# EAGLE board pbusRX8E (EAGLE 6.6.0)
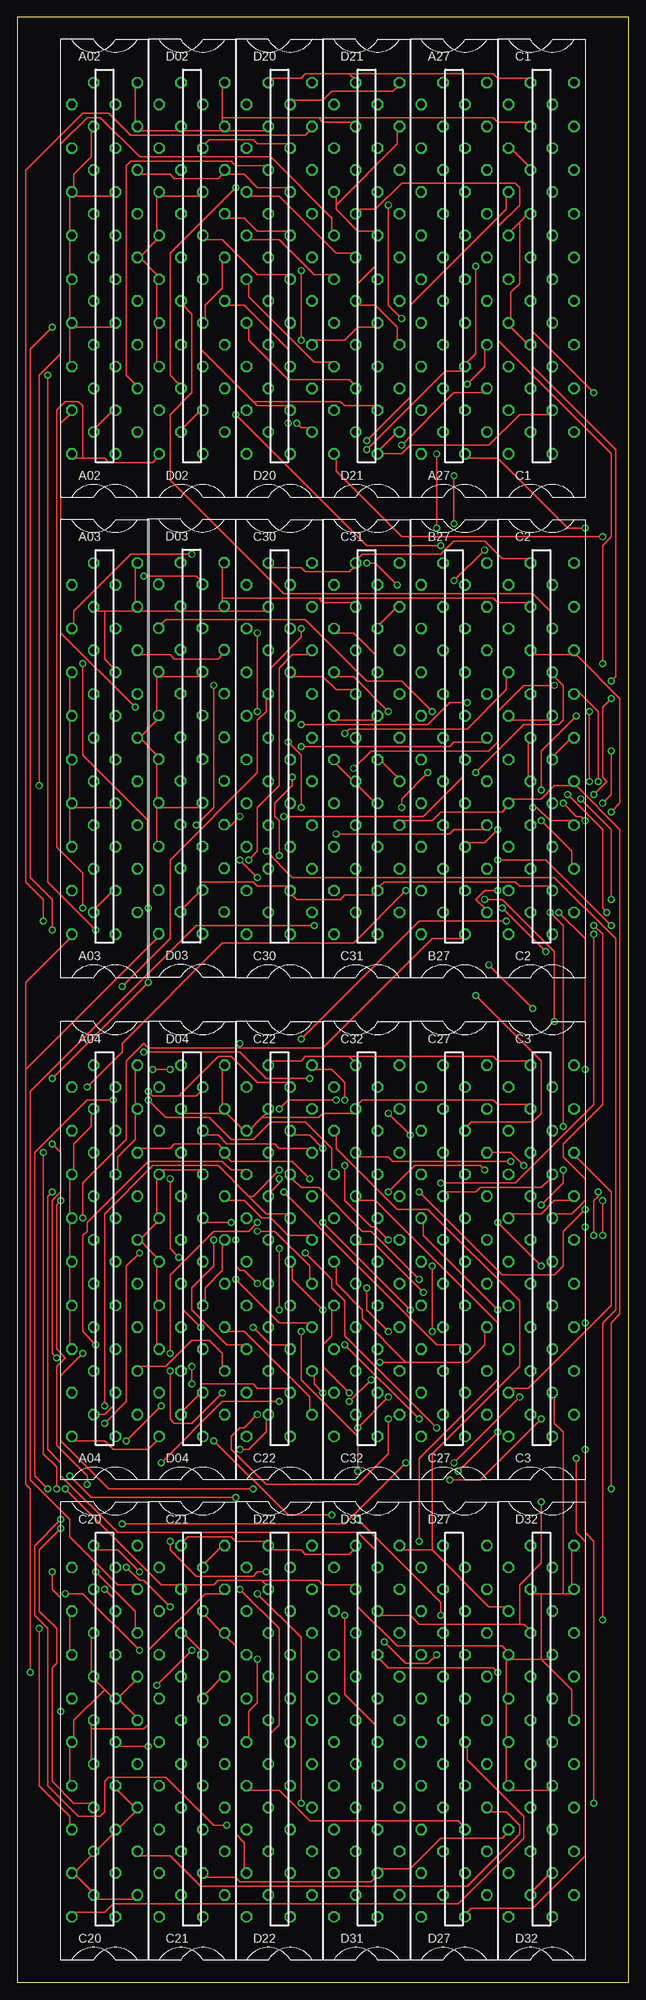
[diagram p1: board, top side]
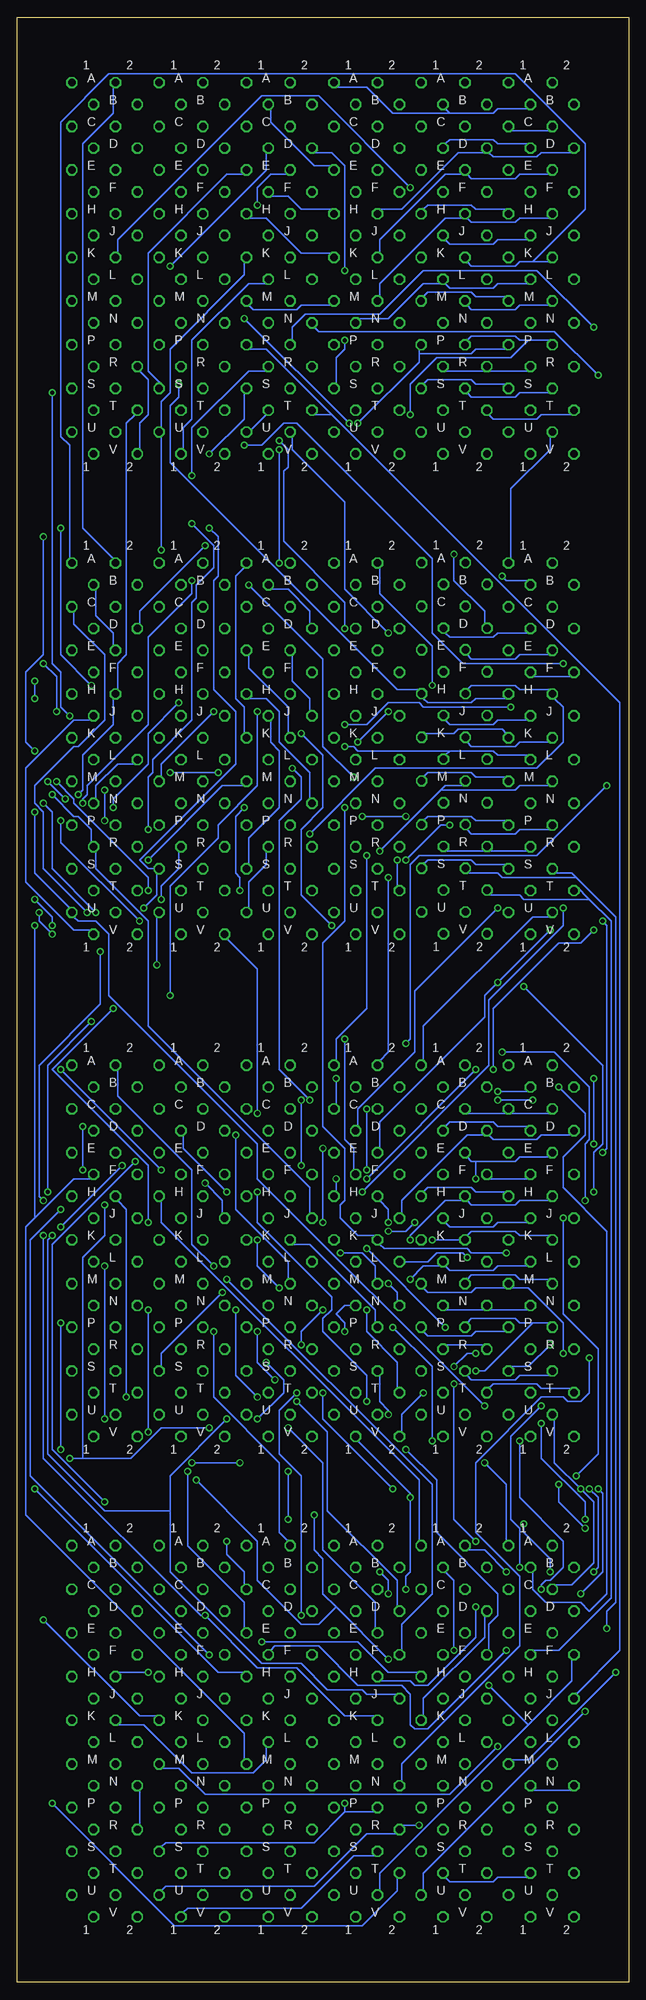
[diagram p2: board, bottom side, seen from below]

Size 88.9 x 285.75 mm. Coordinates in mm from the lower left corner, seen from the top.
Outline: 0,0 88.9,0 88.9,285.75 0,285.75 0,0
Copper layers (1*16): Top 0.035mm / dielectric 1.5mm / Bottom 0.035mm
Design rules "olimex10mil": minimum track width 10mil, minimum drill 24mil, track to track 10mil, track to pad 10mil, pad to pad 10mil, via to via 10mil, smd to smd 10mil, copper to edge 40mil, drill to drill 10mil, minimum pad ring 10mil, minimum via ring 8mil, stop-mask expansion 0mil, vias tented up to drill 0mil, thermal gap 10mil
Net classes: 1 Supply: width 1.905 mm, clearance 0.508 mm

## Footprints (pad centres in the part's own frame; a part is rotated, then mirrored left to right if it is on the bottom)
H807 = drill 1.092 octagon: A1 4.763,28.575; A2 -1.587,28.575; B1 1.587,25.4; B2 -4.763,25.4; C1 4.763,22.225; C2 -1.587,22.225; D1 1.587,19.05; D2 -4.763,19.05; E1 4.763,15.875; E2 -1.587,15.875; F1 1.587,12.7; F2 -4.763,12.7; H1 4.763,9.525; H2 -1.587,9.525; J1 1.587,6.35; J2 -4.763,6.35; K1 4.763,3.175; K2 -1.587,3.175; L1 1.587,0; L2 -4.763,0; M1 4.763,-3.175; M2 -1.587,-3.175; N1 1.587,-6.35; N2 -4.763,-6.35; P1 4.763,-9.525; P2 -1.587,-9.525; R1 1.587,-12.7; R2 -4.763,-12.7; S1 4.763,-15.875; S2 -1.587,-15.875; T1 1.587,-19.05; T2 -4.763,-19.05; U1 4.763,-22.225; U2 -1.587,-22.225; V1 1.587,-25.4; V2 -4.763,-25.4

## Placement (x,y rotation side)
A02  M903  [H807]  12.7,247.65 0 top
A03  M903  [H807]  12.7,177.8 0 top
A04  M903  [H807]  12.7,104.78 0 top
A27  [H807]  63.5,247.65 0 top
B27  [H807]  63.5,177.8 0 top
C1  [H807]  76.2,247.65 0 top
C2  [H807]  76.2,177.8 0 top
C3  M310  [H807]  76.2,104.78 0 top
C20  [H807]  12.7,34.92 0 top
C21  [H807]  25.4,34.92 0 top
C22  M624  [H807]  38.1,104.78 0 top
C27  [H807]  63.5,104.78 0 top
C30  M310  [H807]  38.1,177.8 0 top
C31  [H807]  50.8,177.8 0 top
C32  M002  [H807]  50.8,104.78 0 top
D02  M903  [H807]  25.4,247.65 0 top
D03  M903  [H807]  25.34,177.86 0 top
D04  M903  [H807]  25.4,104.78 0 top
D20  [H807]  38.1,247.65 0 top
D21  [H807]  50.8,247.65 0 top
D22  M002  [H807]  38.1,34.92 0 top
D27  [H807]  63.5,34.92 0 top
D31  [H807]  50.8,34.92 0 top
D32  M903  [H807]  76.2,34.92 0 top

## Tracks (layer width: path | path; a pad name or v marks a point on that pad's centre or on a via)
AC00L  (via drill 0.61)
  Top 0.254: v19.05,129.54 19.68,128.91 23.5,128.91 | 23.5,128.91 26.04,128.91 26.67,129.54 D04.B1 | 23.5,128.91 29.21,134.62 31.11,134.62 34.92,130.81 39.37,130.81 C22.B1
  Bottom 0.254: v19.05,129.54 14.61,129.54 A04.B1
AC01L
  Top 0.254: C22.E1 42.55,121.28 38.1,121.28 37.47,121.92 30.48,121.92 29.21,123.19 27.3,123.19 D04.D1
  Bottom 0.254: A04.D1 14.61,124.46 19.05,124.46 19.68,125.09 26.04,125.09 26.67,124.46 D04.D1
AC02L  (via drill 0.61)
  Top 0.254: A04.E1 17.78,121.28 22.23,121.28 22.86,121.92 29.21,121.92 29.84,121.28 D04.E1 30.48,120.02 31.11,119.38 40.01,119.38 v42.55,116.84
  Bottom 0.254: v42.55,116.84 42.55,114.94 C22.H1
AC03L
  Top 0.254: C22.K1 42.55,108.58 39.37,108.58 36.83,111.12 35.56,111.12 33.02,113.67 30.48,113.67 D04.H1
  Bottom 0.254: A04.H1 17.78,114.94 22.23,114.94 22.86,115.57 29.21,115.57 29.84,114.94 D04.H1
AC04L  (via drill 0.61)
  Top 0.254: v34.92,109.22 37.47,109.22 42.55,104.14 42.55,102.23 C22.M1 | v31.11,110.49 27.3,110.49 D04.J1
  Bottom 0.254: A04.J1 14.61,110.49 19.05,110.49 19.68,109.86 26.04,109.86 26.67,110.49 D04.J1 | v34.92,109.22 32.38,109.22 v31.11,110.49
AC05L  (via drill 0.61)
  Top 0.254: v31.75,102.23 38.1,95.89 42.55,95.89 C22.P1
  Bottom 0.254: A04.L1 14.61,104.14 19.05,104.14 19.68,103.5 26.04,103.5 26.67,104.14 D04.L1 27.3,104.14 29.84,104.14 v31.75,102.23
AC06L  (via drill 0.61)
  Top 0.254: v44.45,85.72 43.18,87 43.18,88.27 C22.S1 | v34.29,71.75 13.34,71.75 6.35,78.74 6.35,88.27 v9.53,91.44
  Bottom 0.254: D04.M1 29.84,100.97 29.21,100.33 22.86,100.33 22.23,100.97 17.78,100.97 A04.M1 17.14,100.97 14.61,100.97 9.53,95.89 v9.53,91.44 | v44.45,85.72 44.45,81.92 v34.29,71.75
AC07L
  Top 0.254: C22.U1 42.55,83.19 42.55,85.09 33.02,94.61 30.48,94.61 D04.P1
  Bottom 0.254: A04.P1 17.78,94.61 22.23,94.61 22.86,93.98 29.21,93.98 29.84,94.61 D04.P1
AC08L  (via drill 0.61)
  Top 0.254: A04.S1 17.78,89.53 21.59,89.53 25.4,93.34 27.94,93.34 29.84,91.44 29.84,89.53 D04.S1 | v11.43,92.71 9.53,94.61 9.53,108.58 10.16,109.22 10.16,110.49 19.05,119.38 29.84,119.38 31.11,118.11 33.02,118.11 C22.F2
  Bottom 0.254: v11.43,92.71 14.61,89.53 17.14,89.53 A04.S1
AC09L
  Bottom 0.254: A04.D2 8.26,123.19 12.7,123.19 13.34,122.56 19.68,122.56 20.32,123.19 D04.D2 20.95,123.19 23.5,123.19 33.02,113.67 33.02,111.76 C22.J2
AC10L  (via drill 0.61)
  Top 0.254: v23.5,105.41 22.23,106.68 v22.23,116.84
  Bottom 0.254: 22.23,119.38 22.86,119.38 23.5,120.02 D04.E2 | 22.23,119.38 16.51,119.38 15.88,120.02 11.43,120.02 A04.E2 | v23.5,105.41 24.13,106.05 27.94,106.05 29.21,104.78 C22.L2 | v22.23,116.84 22.23,119.38
AC11L  (via drill 0.61)
  Top 0.254: v34.92,101.6 33.02,103.5 32.38,103.5 31.75,104.14 v31.75,107.95
  Bottom 0.254: A04.H2 11.43,113.67 15.88,113.67 16.51,113.03 22.86,113.03 23.5,113.67 D04.H2 24.13,113.67 26.67,113.67 31.75,108.58 v31.75,107.95 | v34.92,101.6 33.66,100.33 33.66,99.06 C22.N2
BAC00
  Bottom 0.254: 26.04,271.78 19.68,271.78 19.05,272.42 14.61,272.42 A02.B1 | 26.04,271.78 26.67,272.42 D02.B1 | 26.04,271.78 34.29,271.78 38.1,275.59 42.55,275.59 D20.A1
BAC01
  Top 0.254: D20.D1 39.37,267.33 34.92,267.33 34.29,267.97 27.94,267.97 27.3,267.33 D02.D1
  Bottom 0.254: A02.D1 14.61,267.33 19.05,267.33 19.68,267.97 26.04,267.97 26.67,267.33 D02.D1
BAC02
  Top 0.254: A02.E1 17.78,262.89 22.23,262.89 22.86,262.25 29.21,262.25 29.84,262.89 D02.E1 30.48,262.89 33.02,262.89 34.92,260.99 39.37,260.99 D20.F1
BAC03
  Top 0.254: D20.J1 39.37,254.63 34.92,254.63 33.02,256.54 30.48,256.54 D02.H1
  Bottom 0.254: A02.H1 17.78,257.81 22.23,257.81 22.86,258.44 29.21,258.44 29.84,257.81 D02.H1
BAC04
  Top 0.254: D20.L1 39.37,248.28 34.92,248.28 29.84,253.37 27.3,253.37 D02.J1
  Bottom 0.254: A02.J1 14.61,253.37 19.05,253.37 19.68,252.73 26.04,252.73 26.67,253.37 D02.J1
BAC05
  Bottom 0.254: A02.L1 14.61,247.01 19.05,247.01 19.68,246.38 26.04,246.38 26.67,247.01 D02.L1 27.3,247.01 29.84,247.01 34.92,241.94 39.37,241.94 D20.N1
BAC06
  Top 0.254: D20.R1 39.37,235.59 39.37,237.49 33.02,243.84 30.48,243.84 D02.M1
  Bottom 0.254: A02.M1 17.78,245.11 22.23,245.11 22.86,245.75 29.21,245.75 29.84,245.11 D02.M1
BAC07  (via drill 0.61)
  Top 0.254: v39.37,226.69 39.37,222.88 D20.V1
  Bottom 0.254: v39.37,226.69 30.48,235.59 30.48,236.85 | 30.48,236.85 30.48,237.49 D02.P1 | 30.48,236.85 22.86,236.85 22.23,237.49 17.78,237.49 A02.P1
BAC08
  Top 0.254: D20.E2 36.2,264.16 31.75,264.16 31.11,264.8 16.51,264.8 15.88,264.16 15.88,233.68 17.14,232.41 A02.S1
  Bottom 0.254: A02.S1 17.78,232.41 22.23,232.41 22.86,233.04 29.21,233.04 29.84,232.41 D02.S1
BAC09
  Bottom 0.254: A02.D2 8.26,266.06 12.7,266.06 13.34,265.43 19.68,265.43 20.32,266.06 D02.D2 20.95,266.06 24.77,266.06 33.02,257.81 36.2,257.81 D20.H2
BAC10
  Bottom 0.254: A02.E2 11.43,262.89 15.88,262.89 16.51,262.25 22.86,262.25 23.5,262.89 D02.E2 24.13,262.89 26.67,262.89 36.2,253.37 36.2,251.46 D20.K2
BAC11
  Bottom 0.254: A02.H2 11.43,256.54 15.88,256.54 16.51,255.91 22.86,255.91 23.5,256.54 D02.H2 24.13,256.54 26.67,256.54 36.2,247.01 36.2,245.11 D20.M2
BACLR  (via drill 0.61)
  Top 0.254: v29.84,85.72 25.4,81.28 22.86,81.28 22.23,81.92 v22.23,88.9
  Bottom 0.254: 13.97,95.89 15.88,95.89 16.51,96.52 22.86,96.52 23.5,95.89 D04.P2 | 13.97,95.89 11.43,95.89 A04.P2 | v29.84,85.72 33.02,82.55 33.02,80.01 C22.V2 | v22.23,88.9 20.95,88.9 13.97,95.89
BINIT  (via drill 0.61)
  Top 0.254: 9.53,221.62 12.7,221.62 13.34,220.98 19.68,220.98 20.32,221.62 D02.V2 | 9.53,221.62 8.26,221.62 A02.V2 | v38.73,114.94 60.96,92.71 64.77,92.71 C27.R1 | v9.53,156.21 9.53,161.29 5.71,165.1 5.71,228.6 6.99,229.87 8.89,229.87 9.53,229.24 9.53,221.62
  Bottom 0.254: v38.73,114.94 20.32,133.35 20.32,142.88 9.53,153.67 v9.53,156.21
BIOP1
  Bottom 0.254: 13.97,250.19 15.88,250.19 16.51,249.56 22.86,249.56 23.5,250.19 D02.K2 | 13.97,250.19 11.43,250.19 A02.K2 | 13.97,250.19 6.35,257.81 6.35,267.33 16.51,277.5 75.56,277.5 82.55,270.51 82.55,224.79 81.28,223.52 81.28,207.01 C2.A1
BIOP2
  Top 0.254: C2.D1 77.47,197.49 77.47,199.39 74.93,201.93 38.73,201.93 22.23,218.44 22.23,227.97 25.4,231.14 25.4,242.57 24.13,243.84 D02.M2
  Bottom 0.254: A02.M2 11.43,243.84 15.88,243.84 16.51,243.21 22.86,243.21 23.5,243.84 D02.M2
BIOP4  (via drill 0.61)
  Top 0.254: v61.59,208.91 50.8,208.91 v31.75,227.97
  Bottom 0.254: 14.61,238.76 15.88,238.76 16.51,239.4 22.86,239.4 23.5,238.76 D02.P2 | 14.61,238.76 11.43,238.76 A02.P2 | v61.59,208.91 71.12,199.39 71.12,197.49 C2.D2 | v31.75,227.97 31.75,232.41 27.94,236.22 17.14,236.22 14.61,238.76
BIRQ  (via drill 0.61)
  Top 0.254: v38.1,106.68 v38.1,97.79 | v26.67,95.25 24.13,97.79 24.13,100.97 D04.M2
  Bottom 0.254: A04.M2 11.43,102.23 15.88,102.23 16.51,102.87 22.86,102.87 23.5,102.23 D04.M2 | v38.1,97.79 38.1,94.61 33.66,90.17 33.66,86.36 C22.T2 | v26.67,95.25 v38.1,106.68
BMB00  (via drill 0.61)
  Top 0.254: v18.41,204.47 26.04,204.47 26.67,203.84 D03.B1
  Bottom 0.254: v18.41,204.47 17.78,203.84 14.61,203.84 A03.B1
BMB01
  Bottom 0.254: A03.D1 14.61,196.22 19.05,196.22 19.68,195.58 26.04,195.58 26.67,196.22 D03.D1
BMB02
  Top 0.254: A03.E1 17.78,193.04 22.23,193.04 22.86,192.41 29.21,192.41 29.84,193.04 D03.E1
BMB03
  Bottom 0.254: A03.J1 14.61,183.51 19.05,183.51 19.68,182.88 26.04,182.88 26.67,183.51 D03.J1
BMB03L  (via drill 0.61)
  Top 0.254: v65.41,232.41 67.94,234.95 67.94,237.49 A27.P1
  Bottom 0.254: A03.H1 17.78,186.69 22.23,186.69 22.86,186.06 29.21,186.06 29.84,186.69 D03.H1 30.48,187.96 33.66,187.96 66.67,220.98 66.67,229.24 65.41,230.5 v65.41,232.41
BMB04
  Bottom 0.254: A03.M1 17.78,175.26 22.23,175.26 22.86,175.9 29.21,175.9 29.84,175.26 D03.M1
BMB04L  (via drill 0.61)
  Top 0.254: v41.27,179.71 62.87,179.71 63.5,180.34 67.94,180.34 B27.K1
  Bottom 0.254: 26.04,179.07 19.68,179.07 19.05,178.44 14.61,178.44 A03.L1 | 26.04,179.07 26.67,178.44 D03.L1 | v41.27,179.71 40.01,179.71 39.37,179.07 26.04,179.07
BMB05
  Bottom 0.254: A03.S1 17.78,162.56 22.23,162.56 22.86,163.19 29.21,163.19 29.84,162.56 D03.S1
BMB05L  (via drill 0.61)
  Top 0.254: v38.73,169.54 59.05,169.54 64.77,175.26 64.77,177.16 B27.L1 | v32.38,169.54 30.48,167.64 D03.P1
  Bottom 0.254: A03.P1 17.78,168.91 22.23,168.91 22.86,169.54 29.21,169.54 29.84,168.91 D03.P1 | v32.38,169.54 v38.73,169.54
BMB06
  Bottom 0.254: A03.E2 11.43,193.04 15.88,193.04 16.51,192.41 22.86,192.41 23.5,193.04 D03.E2
BMB06L  (via drill 0.61)
  Top 0.254: v25.4,207.65 16.51,207.65 8.26,199.39 8.26,197.49 A03.D2 | v60.33,184.78 55.88,189.23 50.8,189.23 41.91,198.12 21.59,198.12 20.95,197.49 D03.D2
  Bottom 0.254: v25.4,207.65 25.4,203.84 20.95,199.39 20.95,197.49 D03.D2 | v60.33,184.78 67.94,177.16 67.94,175.26 B27.M1
BMB07
  Bottom 0.254: A03.K2 11.43,180.34 15.88,180.34 16.51,179.71 22.86,179.71 23.5,180.34 D03.K2
BMB07L  (via drill 0.61)
  Top 0.254: v46.35,167 62.87,167 63.5,167.64 67.94,167.64 B27.P1
  Bottom 0.254: D03.H2 23.5,187.96 22.86,188.59 16.51,188.59 15.88,187.96 11.43,187.96 A03.H2 10.79,186.69 9.53,185.42 9.53,180.34 13.34,176.53 36.83,176.53 v46.35,167
BMB08
  Bottom 0.254: A03.P2 11.43,167.64 15.88,167.64 16.51,167 22.86,167 23.5,167.64 D03.P2
BMB08L  (via drill 0.61)
  Top 0.254: v85.09,52.7 85.09,95.89 87,97.79 87,151.76 78.11,160.66 40.01,160.66 v36.2,164.47
  Bottom 0.254: v85.09,52.7 71.12,38.73 68.58,38.73 D27.K1 | 27.3,173.35 26.67,173.99 24.13,173.99 D03.M2 | v36.2,164.47 27.3,173.35 | 27.3,173.35 16.51,173.35 15.88,173.99 11.43,173.99 A03.M2
BMB09  (via drill 0.61)
  Top 0.254: v3.17,51.44 3.17,28.57 7.62,24.13 7.62,22.86 C20.R2
  Bottom 0.254: v3.17,51.44 3.17,53.98 1.91,55.24 1.91,154.94 7.62,160.66 | 7.62,160.66 8.26,161.29 10.79,161.29 A03.S2 | 7.62,160.66 18.41,160.66 19.05,161.29 23.5,161.29 D03.S2
BMB10
  Bottom 0.254: 5.71,157.48 7.62,159.38 A03.T2 | 5.71,157.48 2.54,154.31 2.54,55.88 10.16,48.26 13.97,48.26 C20.F1 | 5.71,157.48 15.24,157.48 15.88,158.12 20.32,158.12 D03.T2
BMB11  (via drill 0.61)
  Top 0.254: v1.91,45.09 1.91,71.75 1.27,72.39 1.27,132.72 | 1.27,132.72 1.27,145.41 7.62,151.76 A03.V2 | 1.27,132.72 20.32,151.76 D03.V2
  Bottom 0.254: v1.91,45.09 14.61,32.38 17.14,32.38 C20.M1
BRD_L  (via drill 0.61)
  Top 0.254: v6.35,66.04 3.17,62.87 3.17,53.98 5.71,51.44 5.71,46.35 5.08,45.72 5.08,29.21 8.26,26.04 10.79,26.04 C20.P2 | v10.16,72.39 10.16,73.66 5.71,78.11 5.71,89.53 6.99,90.81 5.71,92.08 5.71,113.03 v6.35,113.67 | v18.41,135.25 32.38,135.25 36.2,131.44 v42.55,131.44
  Bottom 0.254: v6.35,66.04 10.16,69.85 v10.16,72.39 | v6.35,113.67 6.35,121.92 5.71,122.56 5.71,130.18 10.79,135.25 v18.41,135.25 | v42.55,131.44 42.55,127.64 C22.C1
BRUN
  Bottom 0.254: A04.S2 11.43,88.27 15.88,88.27 16.51,87.63 22.86,87.63 23.5,88.27 D04.S2
BSKIP  (via drill 0.61)
  Top 0.254: v28.57,107.95 28.57,104.14 25.4,100.97 25.4,97.79 30.48,92.71 33.02,92.71 C22.R2
  Bottom 0.254: A04.K2 11.43,108.58 15.88,108.58 16.51,109.22 22.86,109.22 23.5,108.58 D04.K2 v28.57,107.95
BTS1  (via drill 0.61)
  Top 0.254: v74.93,170.81 75.56,170.81 77.47,168.91 80.64,168.91 C2.P1 | v65.41,186.06 62.87,186.06 59.69,182.88 v41.27,182.88 | v17.14,185.42 6.35,196.22 6.35,226.69 7.62,227.97 A02.T2
  Bottom 0.254: A02.T2 8.26,227.97 12.7,227.97 13.34,227.33 19.68,227.33 20.32,227.97 D02.T2 | v74.93,170.81 74.93,172.09 69.85,177.16 69.85,181.61 v65.41,186.06 | v41.27,182.88 38.1,182.88 34.92,186.06 30.48,186.06 29.84,185.42 v17.14,185.42
BTS3  (via drill 0.61)
  Top 0.254: v31.75,260.99 22.23,251.46 22.23,233.68 23.5,232.41 D02.S2
  Bottom 0.254: A02.S2 11.43,231.14 15.88,231.14 16.51,230.5 22.86,230.5 23.5,231.14 D02.S2 | v31.75,260.99 45.09,274.32 53.34,274.32 74.3,253.37 74.3,251.46 C1.K2
BWR_L
  Top 0.254: 46.35,258.44 46.35,257.81 49.53,254.63 52.07,254.63 D21.J1 52.07,253.37 52.07,249.56 49.53,247.01 49.53,245.11 D21.M2 49.53,243.84 52.07,243.84 55.24,240.66 55.24,238.76 D21.P1 | 46.35,258.44 46.35,259.71 D21.F2 | 46.35,258.44 55.24,267.33 55.24,269.24 D21.C1
  Bottom 0.254: 43.18,227.97 1.27,186.06 1.27,48.26 7.62,41.91 C20.J2 | 43.18,227.97 45.72,227.97 D21.T2 | 43.18,227.97 52.7,237.49 55.24,237.49 D21.P1
C0L  (via drill 0.61)
  Top 0.254: D22.T2 33.02,16.51 33.02,20.32 31.75,21.59 31.75,48.9 30.48,50.16 C21.E1 29.84,50.8 27.3,53.34 C21.D1 | v73.66,118.75 71.75,120.65 C27.E1 | v82.55,95.89 v82.55,109.86 | v82.55,77.47 82.55,65.41 83.82,64.14 v83.82,26.04
  Bottom 0.254: v82.55,109.86 v73.66,118.75 | v82.55,77.47 v82.55,95.89 | v83.82,26.04 66.04,8.26 38.73,8.26 33.66,13.34 33.66,15.24 D22.T2
C1L  (via drill 0.61)
  Top 0.254: C20.F2 7.62,48.26 7.62,53.34 C20.D2 | C21.B1 27.3,60.96 29.84,63.5 C21.A1 | v20.32,43.18 v25.4,48.26
  Bottom 0.254: 14.61,37.47 8.26,43.81 8.26,46.99 C20.F2 | 14.61,37.47 36.2,15.88 36.2,13.34 D22.U2 | C27.H1 67.94,113.67 67.94,110.49 30.48,73.03 30.48,64.14 C21.A1 | 14.61,37.47 v20.32,43.18 | v25.4,48.26 25.4,58.42 26.67,59.69 C21.B1
C20U1
  Top 0.254: 14.61,41.27 17.14,38.73 C20.K1 | 12.7,42.55 13.97,41.27 C20.J1 14.61,41.27 | 12.7,42.55 11.43,43.81 C20.H2 10.79,45.09 10.79,50.16 C20.E2 | 14.61,41.27 17.14,43.81 C20.H1 | C20.N2 7.62,29.21 7.62,34.29 C20.L2 8.26,35.56 8.26,38.1 12.7,42.55 | 8.26,15.88 10.79,13.34 C20.U2 11.43,12.06 17.14,12.06 C20.U1 | 8.26,15.88 10.79,18.41 C20.S2 11.43,19.05 13.97,21.59 C20.R1 14.61,22.23 17.14,24.77 C20.P1 17.14,25.4 14.61,27.94 C20.N1 | 8.26,15.88 C20.T2
  Bottom 0.254: C20.N2 8.26,27.94 13.97,27.94 C20.N1
C21U1  (via drill 0.61)
  Top 0.254: v6.35,39.37 6.35,55.88 5.08,57.15 v5.08,59.69 | v5.71,71.75 5.71,74.93 3.81,76.83 v3.81,120.65 | v3.81,154.31 3.81,157.48 1.27,160.02 1.27,263.52 9.53,271.78 13.34,271.78 16.51,268.61 41.91,268.61 42.55,269.24 D20.C1
  Bottom 0.254: v6.35,39.37 29.84,15.88 29.84,13.34 C21.U1 | v5.08,59.69 4.45,60.33 4.45,70.48 v5.71,71.75 | v3.81,120.65 3.17,121.28 3.17,153.67 v3.81,154.31
C32H2  (via drill 0.61)
  Top 0.254: v58.42,64.14 58.42,76.2 69.85,87.63 69.85,95.89 52.07,113.67 49.53,113.67 C32.H2
  Bottom 0.254: v58.42,64.14 58.42,62.23 55.88,59.69 55.88,57.78 D31.C1
DATA00LL  (via drill 0.61)
  Top 0.254: v66.67,249.56 66.67,236.85 65.41,235.59 A27.R1 64.77,234.31 62.23,234.31 v50.8,222.88 | v51.44,87.63 v48.26,84.45 | v53.98,94.61 50.8,97.79 v50.8,100.97 | v53.98,107.95 52.07,109.86 51.44,109.86 47.62,113.67 v47.62,118.75 | v47.62,128.27 47.62,130.81 45.72,132.72 43.18,132.72 C22.A1 | v50.8,206.38 52.07,206.38 v55.24,203.2 | v40.01,175.26 40.01,173.99 37.47,171.45 37.47,169.54 38.1,168.91 v38.1,163.83
  Bottom 0.254: v66.67,249.56 52.7,263.52 52.7,266.06 D21.D1 | v48.26,84.45 43.81,80.01 43.81,68.58 33.66,58.42 33.66,54.61 D22.D2 | v51.44,87.63 53.98,90.17 v53.98,94.61 | v50.8,100.97 53.98,104.14 v53.98,107.95 | v47.62,128.27 v47.62,118.75 | v50.8,206.38 v50.8,222.88 | v55.24,203.2 44.45,192.41 44.45,179.71 v40.01,175.26 | v38.1,163.83 38.1,141.6 42.55,137.16 42.55,133.99 C22.A1
DATA01L  (via drill 0.61)
  Top 0.254: v53.98,85.09 v49.53,80.64 | v44.45,110.49 v57.15,97.79 | v44.45,121.28 42.55,123.19 40.01,123.19 C22.D1 | v55.88,223.52 63.5,231.14 67.94,231.14 A27.S1 | v9.53,191.77 9.53,178.44 19.05,168.91 v19.05,156.21
  Bottom 0.254: D21.E1 55.88,262.89 58.42,262.89 69.85,251.46 69.85,234.31 67.94,232.41 A27.S1 | v49.53,80.64 44.45,75.56 44.45,62.87 36.83,55.24 36.83,51.44 D22.E2 | v53.98,85.09 57.15,88.27 v57.15,97.79 | v44.45,121.28 v44.45,110.49 | v55.88,223.52 53.34,223.52 50.16,226.69 48.26,226.69 28.57,207.01 28.57,196.22 24.13,191.77 v9.53,191.77 | v19.05,156.21 31.11,144.15 31.11,135.25 39.37,127 39.37,124.46 C22.D1
DATA02L  (via drill 0.61)
  Top 0.254: v58.42,102.23 51.44,109.22 50.16,109.22 43.81,115.57 41.27,115.57 40.01,116.84 C22.F1 | v63.5,203.84 v67.94,208.28 | v79.38,171.45 81.28,169.54 81.92,169.54 v82.55,168.91 | v71.12,154.31 58.42,154.31 v41.27,137.16
  Bottom 0.254: D21.K1 55.88,250.19 55.88,248.28 66.67,237.49 66.67,231.14 67.94,229.87 67.94,226.06 A27.U1 67.94,224.79 v67.94,208.28 | v58.42,102.23 28.57,72.39 28.57,56.52 33.02,52.07 33.02,48.26 D22.F2 | v63.5,203.84 63.5,201.93 69.85,195.58 69.85,182.88 78.74,173.99 78.74,172.72 79.38,172.09 v79.38,171.45 | v82.55,168.91 82.55,165.74 v71.12,154.31 | v41.27,137.16 41.27,122.56 40.01,121.28 40.01,118.11 C22.F1
DATA03L  (via drill 0.61)
  Top 0.254: v22.23,54.61 18.41,58.42 17.78,58.42 v15.88,60.33 | v12.7,83.82 12.7,111.76 19.68,118.75 29.21,118.75 33.66,114.3 | 33.66,114.3 36.2,111.76 39.37,111.76 C22.J1 | v82.55,211.46 80.01,211.46 69.85,221.62 65.41,221.62 A27.V1 | v78.11,188.59 73.66,188.59 69.85,184.78 69.85,180.34 68.58,179.07 51.44,179.07 v48.9,176.53 | v46.35,128.27 39.37,128.27 v38.1,127 | v38.1,118.11 34.29,114.3 33.66,114.3
  Bottom 0.254: D21.L1 52.7,247.01 55.24,247.01 63.5,238.76 63.5,227.33 64.77,226.06 64.77,222.88 A27.V1 | v22.23,54.61 22.23,50.16 29.21,43.18 31.11,43.18 31.75,43.81 36.2,43.81 D22.H2 | v15.88,60.33 15.88,66.04 17.14,67.31 17.14,79.38 v12.7,83.82 | v82.55,211.46 82.55,193.04 v78.11,188.59 | v48.9,176.53 47.62,175.26 47.62,172.09 50.8,168.91 50.8,132.72 v46.35,128.27 | v38.1,127 v38.1,118.11
DATA04L  (via drill 0.61)
  Top 0.254: v63.5,212.09 v63.5,219.07 | v69.85,167.64 67.94,165.74 65.41,165.74 B27.R1 | v58.42,81.92 v47.62,92.71 | v44.45,97.79 40.01,102.23 40.01,104.14 C22.L1 | v67.94,157.48 70.48,157.48 78.11,149.86 v78.11,139.7 | v84.45,114.94 84.45,114.3 83.82,113.67 v83.82,108.58
  Bottom 0.254: v63.5,219.07 63.5,226.06 55.24,234.31 52.7,234.31 D21.R1 | v63.5,212.09 60.33,208.91 60.33,205.74 62.87,203.2 62.87,201.29 63.5,200.66 63.5,183.51 69.22,177.8 69.22,175.9 69.85,175.26 v69.85,167.64 | 66.67,68.58 66.67,73.66 v58.42,81.92 | 66.67,68.58 66.67,59.69 53.34,46.35 47.62,46.35 43.81,42.55 38.73,42.55 38.1,41.91 33.66,41.91 D22.J2 | v47.62,92.71 47.62,94.61 v44.45,97.79 | v67.94,157.48 67.94,159.38 65.41,161.93 65.41,164.47 B27.R1 | v78.11,139.7 84.45,133.35 v84.45,114.94 | v83.82,108.58 84.45,107.95 84.45,76.83 76.2,68.58 66.67,68.58
DATA05L  (via drill 0.61)
  Top 0.254: v60.96,211.46 v60.96,222.25 | v61.59,53.34 61.59,55.24 v49.53,67.31 | v49.53,74.3 49.53,79.38 41.27,87.63 v41.27,94.61 | v70.48,156.21 v76.83,149.86 | v85.09,113.67 v85.09,108.58
  Bottom 0.254: v60.96,222.25 55.88,227.33 55.88,231.14 D21.S1 | v60.96,211.46 59.69,210.19 59.69,204.47 60.33,203.84 60.33,187.96 57.15,184.78 57.15,177.16 71.12,163.19 69.85,161.93 B27.S1 68.58,161.29 68.58,158.12 v70.48,156.21 | v49.53,67.31 v49.53,74.3 | v41.27,94.61 41.27,95.89 42.55,97.16 41.27,98.42 C22.N1 | D22.K2 36.83,38.73 41.27,38.73 48.26,45.72 53.98,45.72 v61.59,53.34 62.23,53.34 85.09,76.2 v85.09,108.58 | v76.83,149.86 76.83,142.24 85.72,133.35 85.72,114.3 v85.09,113.67
DATA06L  (via drill 0.61)
  Top 0.254: v34.92,46.99 34.92,40.64 33.66,39.37 33.66,35.56 D22.L2 | v45.72,67.94 39.37,67.94 v28.57,78.74 | v34.29,95.25 36.83,92.71 39.37,92.71 C22.R1 | v69.85,158.75 67.94,158.75 66.67,157.48 67.94,156.21 B27.U1 | v83.19,174.62 v83.19,184.78 | v85.09,191.77 85.09,208.91 86.36,210.19 86.36,222.25 69.85,238.76 69.85,255.27 73.03,258.44 73.03,260.99 72.39,261.62 55.88,261.62 52.07,257.81 49.53,257.81 D21.H2 | v62.87,73.03 67.31,73.03 v76.2,81.92 | v69.85,110.49 v76.2,104.14 | v68.58,147.96 v74.93,141.6
  Bottom 0.254: 42.55,54.61 44.45,56.52 44.45,61.59 45.72,62.87 v45.72,67.94 | 42.55,54.61 v34.92,46.99 | v28.57,78.74 28.57,89.53 v34.29,95.25 | v69.85,158.75 69.85,160.66 80.64,171.45 80.64,172.09 v83.19,174.62 | v83.19,184.78 83.19,189.87 v85.09,191.77 | 42.55,54.61 45.09,52.07 47.62,52.07 53.98,58.42 53.98,64.14 v62.87,73.03 | v76.2,104.14 v76.2,81.92 | v69.85,110.49 69.85,118.75 83.82,132.72 v74.93,141.6 | v68.58,147.96 68.58,154.94 B27.U1
DATA07L  (via drill 0.61)
  Top 0.254: v32.38,57.15 38.1,51.44 38.1,37.47 36.83,36.2 36.83,32.38 D22.M2 | 32.38,135.89 19.05,135.89 18.41,136.53 15.88,133.99 15.88,122.56 9.53,116.2 v9.53,111.12 | 32.38,135.89 44.45,135.89 60.33,151.76 64.77,151.76 B27.V1 | v7.62,73.66 10.79,70.48 v31.75,70.48 | v3.17,173.99 3.17,233.68 6.35,236.85 6.35,267.33 10.16,271.14 12.06,271.14 17.78,265.43 36.83,265.43 45.72,256.54 45.72,254.63 D21.J2 | v32.38,136.53 32.38,135.89
  Bottom 0.254: v32.38,57.15 32.38,59.05 31.75,59.69 v31.75,70.48 31.75,71.12 39.37,78.74 C22.V1 | v9.53,111.12 9.53,97.16 4.45,92.08 4.45,76.83 v7.62,73.66 | v3.17,173.99 13.34,163.83 30.48,163.83 31.75,162.56 31.75,137.16 v32.38,136.53
DATA08L  (via drill 0.61)
  Top 0.254: D22.N2 33.66,27.94 38.1,27.94 42.55,23.5 64.14,23.5 64.77,22.86 D27.R1 | v11.43,153.03 4.45,160.02 v4.45,233.68 | v5.71,90.81 5.08,91.44 5.08,113.67 6.35,114.94 6.35,120.65 v5.08,121.92 | v19.05,145.41 v5.08,131.44
  Bottom 0.254: v11.43,153.03 v19.05,145.41 20.95,143.51 20.95,140.34 36.2,125.09 36.2,121.28 C22.E2 | v4.45,233.68 10.79,240.03 45.09,240.03 45.72,240.66 D21.N2 | v5.71,90.81 5.71,85.72 6.99,84.45 8.89,84.45 9.53,85.09 12.7,85.09 22.23,75.56 22.23,65.41 15.88,59.05 15.88,48.9 33.02,31.75 33.02,29.21 D22.N2 | v5.08,131.44 v5.08,121.92
DATA09L  (via drill 0.61)
  Top 0.254: v38.1,116.84 38.1,116.2 36.83,114.94 C22.H2 | v19.68,132.72 v22.23,132.72 | v5.08,153.03 5.08,157.48 1.91,160.66 1.91,237.49 v5.08,240.66 | v41.27,26.04 41.27,50.16 v34.92,56.52 | v36.2,59.69 34.92,59.69 34.29,59.05 26.04,59.05 22.23,62.87 v22.23,64.14 | v25.4,89.53 v25.4,87 | v22.23,91.44 22.23,102.87 28.57,109.22 33.66,109.22 v34.92,110.49
  Bottom 0.254: 41.27,24.77 36.83,24.77 D22.P2 | 41.27,24.77 45.72,20.32 67.31,20.32 67.94,19.68 D27.S1 | v22.23,132.72 v38.1,116.84 | v19.68,132.72 19.68,141.6 10.16,151.13 6.99,151.13 v5.08,153.03 | v5.08,240.66 13.34,248.92 29.84,248.92 36.2,242.57 46.99,242.57 48.9,240.66 48.9,238.76 D21.P2 | v41.27,26.04 41.27,24.77 | v34.92,56.52 34.92,58.42 v36.2,59.69 | v22.23,64.14 25.4,67.31 v25.4,87 | v25.4,89.53 23.5,91.44 v22.23,91.44 | v34.92,110.49 34.92,112.39 36.2,113.67 C22.H2
DATA10L  (via drill 0.61)
  Top 0.254: v41.27,170.81 41.27,178.44 v39.37,180.34 | v34.92,196.22 v34.92,184.78 | v30.48,22.86 28.57,22.86 21.59,29.84 13.34,29.84 12.7,29.21 12.7,24.77 12.06,24.13 8.89,24.13 4.45,28.57 4.45,51.44 2.54,53.34 2.54,63.5 v6.35,67.31 | v12.7,81.28 15.88,84.45 15.88,104.14 v17.78,106.05
  Bottom 0.254: D27.U1 67.94,13.34 67.31,13.97 45.72,13.97 38.1,21.59 33.66,21.59 D22.R2 33.02,22.86 v30.48,22.86 | v41.27,170.81 41.27,154.31 44.45,151.13 44.45,124.46 41.27,121.28 41.27,113.67 41.91,113.03 41.91,111.12 39.37,108.58 36.83,108.58 C22.K2 36.2,107.31 35.56,106.68 23.5,106.68 22.86,106.05 v17.78,106.05 | v34.92,184.78 v39.37,180.34 | v34.92,196.22 41.27,202.56 41.27,215.26 48.9,222.88 48.9,224.79 D21.U2 | v6.35,67.31 6.35,69.85 12.7,76.2 v12.7,81.28
DATA11L  (via drill 0.61)
  Top 0.254: v41.91,106.05 45.72,102.23 45.72,100.97 47.62,99.06 47.62,93.98 v60.96,80.64 | v81.28,76.2 81.28,65.41 82.55,64.14 82.55,18.41 74.93,10.79 66.04,10.79 65.41,10.16 D27.V1 | v85.09,210.19 55.88,210.19 46.35,219.71 46.35,221.62 D21.V2 | v86.36,179.07 86.36,172.72 v85.09,171.45 | v77.47,155.57 79.38,153.67 v79.38,124.46 | v79.38,118.11 79.38,116.2 v76.2,113.03
  Bottom 0.254: D22.S2 36.83,18.41 40.01,18.41 47.62,10.79 64.14,10.79 64.77,10.16 D27.V1 | v41.91,106.05 38.73,106.05 36.83,104.14 36.83,102.23 C22.M2 | v60.96,80.64 67.94,80.64 72.39,76.2 79.38,76.2 | 79.38,76.2 v81.28,76.2 | v85.09,210.19 85.09,193.04 87.63,190.5 87.63,180.34 v86.36,179.07 | v85.09,171.45 83.82,170.18 83.82,161.93 v77.47,155.57 | v79.38,124.46 v79.38,118.11 | v76.2,113.03 76.2,108.58 79.38,105.41 79.38,76.2
GND  (via drill 0.61)
  Top 0.254: 12.7,199.39 17.14,199.39 A03.C1 | 12.7,199.39 11.43,199.39 A03.C2 | A03.A1 17.14,205.74 17.14,200.66 A03.C1 | A03.C1 17.78,199.39 23.5,199.39 D03.C2 24.13,199.39 29.84,199.39 D03.C1 | 29.84,201.29 29.84,205.74 D03.A1 | 29.84,201.29 29.84,200.66 D03.C1 | C30.C2 36.2,199.39 30.48,199.39 D03.C1 | 43.81,201.29 44.45,200.66 48.9,200.66 C31.C2 | 29.84,201.29 43.81,201.29 | 43.81,201.29 69.22,201.29 69.85,200.66 74.3,200.66 C2.C2 | D03.R2 20.32,165.74 20.32,170.81 D03.N2 | D03.N1 26.67,170.81 20.95,170.81 D03.N2 | 17.78,180.97 20.32,178.44 D03.L2 20.32,177.16 20.32,172.09 D03.N2 | 17.78,180.97 20.32,183.51 D03.J2 20.32,184.78 20.32,189.87 D03.F2 20.95,189.87 26.67,189.87 D03.F1 | 17.78,180.97 A03.K1 | A03.U2 11.43,156.21 13.97,158.75 A03.T1 13.97,159.38 13.97,164.47 A03.R1 13.97,165.74 13.97,170.81 | A03.R2 7.62,165.74 7.62,170.81 A03.N2 | A03.N2 7.62,172.09 7.62,177.16 A03.L2 7.62,178.44 7.62,183.51 A03.J2 7.62,184.78 7.62,189.87 A03.F2 | 13.97,170.81 8.26,170.81 A03.N2 | 13.97,170.81 A03.N1 | D03.U2 24.13,156.21 26.67,158.75 D03.T1 26.67,159.38 26.67,160.02 | 26.67,160.02 26.67,164.47 D03.R1 | 26.67,160.02 34.29,160.02 34.92,159.38 39.37,159.38 C30.T1 40.01,158.12 40.64,157.48 46.99,157.48 47.62,158.12 52.07,158.12 C31.T1 52.7,159.38 53.34,160.02 72.39,160.02 73.03,159.38 77.47,159.38 C2.T1 | 12.7,199.39 12.7,192.41 13.97,191.13 A03.F1 | A02.A1 17.14,275.59 17.14,270.51 A02.C1 17.78,269.24 23.5,269.24 D02.C2 24.13,269.24 29.84,269.24 D02.C1 | 29.84,271.14 29.84,275.59 D02.A1 | 29.84,271.14 29.84,270.51 D02.C1 | D20.C2 36.2,269.24 30.48,269.24 D02.C1 | 43.81,271.14 44.45,270.51 48.9,270.51 D21.C2
  Top 0.254: 29.84,271.14 43.81,271.14 | 43.81,271.14 69.22,271.14 69.85,270.51 74.3,270.51 C1.C2 | D02.R2 20.32,235.59 20.32,240.66 D02.N2 20.32,241.94 20.32,247.01 D02.L2 20.32,248.28 17.78,250.82 | 17.78,250.82 20.32,253.37 D02.J2 20.32,254.63 20.32,259.71 D02.F2 20.95,259.71 26.67,259.71 D02.F1 | 17.78,250.82 A02.K1 | A02.U2 11.43,226.06 13.97,228.6 A02.T1 13.97,229.24 13.97,234.31 A02.R1 13.97,235.59 13.97,240.66 | A02.R2 7.62,235.59 7.62,240.66 A02.N2 | A02.N2 7.62,241.94 7.62,247.01 A02.L2 7.62,248.28 7.62,253.37 A02.J2 7.62,254.63 7.62,259.71 A02.F2 | A02.F1 13.97,259.71 8.26,259.71 A02.F2 | 13.97,240.66 8.26,240.66 A02.N2 | 13.97,240.66 A02.N1 | D21.U1 55.24,225.43 52.7,222.88 D21.V1 55.88,222.25 57.15,223.52 68.58,223.52 73.03,227.97 77.47,227.97 C1.T1 | D02.U2 24.13,226.06 26.67,228.6 D02.T1 26.67,229.24 26.67,234.31 D02.R1 26.67,235.59 26.67,237.49 | 26.67,237.49 26.67,240.66 D02.N1 27.3,241.94 27.3,243.84 29.84,246.38 29.84,250.19 D02.K1 | 26.67,237.49 34.29,229.87 | 34.29,229.87 34.92,229.24 39.37,229.24 D20.T1 | 34.29,229.87 46.99,229.87 47.62,229.24 52.07,229.24 D21.T1 | A02.C2 10.79,269.24 10.79,265.43 8.26,262.89 8.26,260.99 A02.F2 | 79.38,56.52 80.64,56.52 D32.C1 80.64,57.78 80.64,62.87 D32.A1 | 76.2,56.52 79.38,56.52 | 76.2,56.52 74.93,56.52 D32.C2 | 79.38,56.52 79.38,80.01 78.11,81.28 78.11,85.09 C3.T1 | 35.56,58.42 29.21,58.42 28.57,57.78 24.13,57.78 C21.C2 23.5,57.78 20.95,57.78 v6.99,71.75 | 35.56,58.42 36.2,57.78 D22.C2 | 35.56,58.42 43.81,58.42 44.45,57.78 48.9,57.78 D31.C2 49.53,56.52 49.53,54.61 55.24,48.9 70.48,48.9 71.12,48.26 D32.F2
  Top 0.254: D32.U2 74.93,13.34 77.47,15.88 D32.T1 77.47,16.51 77.47,21.59 D32.R1 77.47,22.86 77.47,27.94 | D32.R2 71.12,21.59 70.48,20.95 61.59,20.95 57.15,16.51 52.7,16.51 D31.T1 52.07,15.24 51.44,14.61 32.38,14.61 31.75,15.24 27.3,15.24 C21.T1 | D32.F2 71.12,46.99 71.12,41.91 D32.J2 71.12,40.64 71.12,35.56 D32.L2 71.12,34.29 71.12,29.21 D32.N2 71.75,27.94 77.47,27.94 | 76.2,46.99 71.75,46.99 D32.F2 | 76.2,46.99 77.47,46.99 D32.F1 | 76.2,46.99 80.64,42.55 80.64,38.73 D32.K1 | 77.47,27.94 D32.N1 | 76.2,46.99 76.2,56.52 | D04.U2 24.13,83.19 26.67,85.72 D04.T1 26.67,86.36 26.67,87 | 26.67,87 26.67,91.44 D04.R1 | 26.67,87 34.29,87 34.92,86.36 39.37,86.36 C22.T1 | 17.78,107.95 20.32,105.41 D04.L2 20.32,104.14 20.32,99.06 D04.N2 20.32,97.79 20.32,92.71 D04.R2 | 17.78,107.95 20.32,110.49 D04.J2 20.32,111.76 20.32,116.84 D04.F2 20.95,118.11 26.67,118.11 D04.F1 | 17.78,107.95 A04.K1 | A04.N1 13.97,97.79 13.97,92.71 A04.R1 13.97,91.44 13.97,86.36 A04.T1 13.97,85.09 13.97,83.82 12.7,82.55 A04.U2 | D04.K1 29.84,107.31 29.84,103.5 27.3,100.97 27.3,99.06 D04.N1 | A04.R2 7.62,92.71 7.62,97.79 A04.N2 7.62,99.06 7.62,104.14 A04.L2 7.62,105.41 7.62,110.49 A04.J2 7.62,111.76 7.62,116.84 A04.F2 8.26,118.11 8.26,121.92 10.79,124.46 10.79,126.36 A04.C2 | A04.A1 17.14,132.72 17.14,127.64 A04.C1 17.14,126.36 17.14,122.56 14.61,120.02 14.61,118.11 A04.F1 | D04.C1 30.48,126.36 33.02,123.83 C22.D2 33.66,123.83 35.56,125.73 | D04.A1 29.84,132.72 29.84,127.64 D04.C1 | 35.56,125.73 36.2,126.36 C22.C2 | 35.56,125.73 43.81,125.73 44.45,126.36 48.9,126.36 C32.C2 49.53,127.64 50.16,128.27 69.22,128.27 69.85,127.64 74.3,127.64 C3.C2
  Top 0.254: D04.C2 24.13,126.36 29.84,126.36 D04.C1
  Bottom 0.254: D03.K1 29.84,181.61 25.4,181.61 24.77,182.25 18.41,182.25 17.78,181.61 A03.K1 | A03.F1 13.97,189.87 8.26,189.87 A03.F2 | A03.R1 14.61,164.47 20.32,164.47 D03.R2 20.95,164.47 26.67,164.47 D03.R1 | A02.C2 11.43,269.24 17.14,269.24 A02.C1 | A02.R1 14.61,234.31 20.32,234.31 D02.R2 20.95,234.31 26.67,234.31 D02.R1 | D21.T1 52.7,227.97 55.24,225.43 D21.U1 | A03.A1 17.14,207.01 17.14,217.17 11.43,222.88 11.43,224.79 A02.U2 | C20.T1 14.61,15.24 19.05,15.24 19.68,14.61 26.04,14.61 26.67,15.24 C21.T1 | D32.N2 71.12,27.94 71.12,22.86 D32.R2 | C20.C2 10.79,57.78 8.26,57.78 5.08,60.96 5.08,69.85 v6.99,71.75 10.79,75.56 10.79,81.92 A04.U2 | A04.F1 14.61,116.84 20.32,116.84 D04.F2 | D04.N1 26.67,97.79 20.95,97.79 D04.N2 20.32,97.79 14.61,97.79 A04.N1 | D04.R1 26.67,92.71 20.95,92.71 D04.R2 | A04.C2 11.43,126.36 17.14,126.36 A04.C1 17.78,126.36 23.5,126.36 D04.C2 | A03.U2 11.43,154.94 13.97,154.94 29.84,139.06 29.84,133.99 D04.A1
IRQL  (via drill 0.61)
  Top 0.254: v34.92,82.55 33.02,80.64 32.38,80.64 31.11,79.38 31.11,77.47 36.2,72.39 49.53,72.39 53.98,76.83 v53.98,81.92 | 56.52,90.17 65.41,90.17 67.94,92.71 67.94,94.61 C27.P1 | v52.7,90.17 56.52,90.17 | 56.52,90.17 50.16,96.52 50.16,97.79 46.35,101.6 46.35,104.14 C32.L2
  Bottom 0.254: v34.92,82.55 34.92,83.19 36.2,84.45 36.2,88.27 C22.S2 | v53.98,81.92 50.16,85.72 50.16,87.63 v52.7,90.17
MD09L
  Top 0.254: C20.V2 8.26,10.16 12.7,10.16 13.97,11.43 64.14,11.43 73.66,20.95 73.66,24.13 65.41,32.38 65.41,34.29 D27.L1
MD10L  (via drill 0.61)
  Top 0.254: v19.05,34.29 14.61,34.29 C20.L1
  Bottom 0.254: v19.05,34.29 26.04,27.3 61.59,27.3 65.41,31.11 67.94,31.11 D27.M1
MD11L
  Top 0.254: C20.S1 17.78,18.41 22.23,18.41 26.67,13.97 65.41,13.97 73.03,21.59 73.03,22.86 71.12,24.77 68.58,24.77 D27.P1
N$1
  Top 0.254: D20.B1 40.01,273.69 44.45,273.69 45.72,274.95 54.61,274.95 55.24,275.59 D21.A1
N$2
  Bottom 0.254: D20.E1 43.18,264.16 45.72,264.16 52.07,270.51 52.07,272.42 D21.B1
N$3
  Bottom 0.254: D20.H1 43.18,257.81 47.62,257.81 49.53,259.71 52.07,259.71 D21.F1
N$4
  Bottom 0.254: D20.K1 43.18,251.46 47.62,251.46 52.7,256.54 55.24,256.54 D21.H1
N$5
  Top 0.254: D20.P1 43.18,238.76 47.62,238.76 49.53,240.66 52.07,240.66 D21.N1
N$6
  Bottom 0.254: D20.M1 43.18,243.84 47.62,243.84 48.26,243.21 54.61,243.21 55.24,243.84 D21.M1
N$7
  Top 0.254: 10.79,36.83 10.79,37.47 C20.K2 | 10.79,36.83 10.79,32.38 C20.M2 | 10.79,36.83 18.41,36.83 19.05,37.47 19.05,48.26 27.3,56.52 29.84,56.52 C21.C1
N$8
  Top 0.254: D20.N2 33.66,240.66 33.66,238.76 39.37,233.04 48.26,233.04 48.9,232.41 D21.S2
N$9
  Top 0.254: 60.33,62.87 55.88,62.87 D31.A1 | 60.33,62.87 68.58,54.61 71.12,54.61 D32.D2 | 60.33,62.87 60.33,76.83 73.03,89.53 73.03,99.06 59.69,112.39 55.24,112.39 46.35,121.28 46.35,123.19 C32.D2
N$10
  Top 0.254: D20.J2 33.66,253.37 38.1,253.37 43.18,248.28 45.72,248.28 D21.L2
N$11  (via drill 0.61)
  Top 0.254: v40.64,226.69 41.27,226.06 42.55,226.06 D20.U1 | v55.88,241.94 53.98,243.84 v53.98,258.44
  Bottom 0.254: v40.64,226.69 v55.88,241.94 | v53.98,258.44 53.98,260.99 52.07,262.89 49.53,262.89 D21.E2
N$12  (via drill 0.61)
  Top 0.254: v41.27,238.76 v41.27,248.92
  Bottom 0.254: v41.27,238.76 41.27,237.49 42.55,236.22 42.55,232.41 D20.S1 | v41.27,248.92 41.27,264.16 43.18,266.06 45.72,266.06 D21.D2
N$13
  Top 0.254: D20.F2 33.66,259.71 38.1,259.71 46.35,251.46 48.9,251.46 D21.K2
N$14
  Top 0.254: D20.L2 33.66,247.01 33.66,245.11 43.18,235.59 45.72,235.59 D21.R2
N$15  (via drill 0.61)
  Top 0.254: 73.03,52.07 73.66,52.07 74.3,51.44 D32.E2 | 73.03,52.07 58.42,52.07 57.15,53.34 52.7,53.34 D31.D1 | v71.75,119.38 54.61,119.38 53.98,120.02 49.53,120.02 C32.E2 | v76.2,69.85 76.2,60.96 73.03,57.78 73.03,52.07
  Bottom 0.254: v71.75,119.38 83.82,107.31 83.82,77.47 v76.2,69.85
N$16  (via drill 0.61)
  Top 0.254: v69.85,45.09 69.22,45.72 53.98,45.72 52.7,46.99 D31.F1 | v19.05,128.27 21.59,125.73 27.94,125.73 31.11,122.56 34.29,122.56 36.83,125.09 41.91,125.09 45.72,121.28 45.72,118.11 C32.F2 | v13.97,128.27 10.16,128.27 2.54,120.65 2.54,73.66 v4.45,71.75 | v6.99,56.52 9.53,56.52 v17.78,48.26
  Bottom 0.254: v69.85,45.09 74.3,45.09 D32.H2 | v13.97,128.27 v19.05,128.27 | v4.45,71.75 3.81,71.12 3.81,59.69 v6.99,56.52 | v17.78,48.26 29.21,36.83 31.11,36.83 31.75,37.47 31.75,41.91 33.02,43.18 39.37,43.18 45.09,48.9 51.44,48.9 52.07,48.26 D31.F1
N$17  (via drill 0.61)
  Top 0.254: v48.26,85.72 44.45,89.53 44.45,92.71 45.72,93.98 45.72,97.79 C32.N2 | v47.62,53.34 47.62,41.91 52.07,37.47 52.07,35.56 D31.L1
  Bottom 0.254: D31.L1 52.7,34.29 52.7,32.38 54.61,30.48 63.5,30.48 70.48,37.47 74.3,37.47 D32.K2 | v48.26,85.72 50.8,83.19 50.8,76.83 47.62,73.66 v47.62,53.34
N$18
  Top 0.254: C31.J2 46.35,183.51 52.07,183.51 C31.J1
  Bottom 0.254: C31.S1 55.24,162.56 55.24,166.37 50.8,170.81 50.8,179.07 52.07,180.34 52.07,183.51 C31.J1 | C31.E2 48.9,193.04 48.9,189.23 46.35,186.69 46.35,184.78 C31.J2
N$19
  Top 0.254: C21.F1 26.67,48.26 24.13,50.8 C21.E2
N$20
  Bottom 0.254: C21.K1 29.84,38.73 29.84,41.27 20.95,50.16 20.95,53.34 C21.D2
N$21
  Top 0.254: C31.D1 52.7,197.49 55.24,200.03 C31.C1
N$22
  Top 0.254: C31.D2 46.35,196.22 48.9,196.22 52.07,193.04 52.07,191.13 C31.F1
  Bottom 0.254: C31.B1 52.07,202.56 49.53,202.56 46.35,199.39 46.35,197.49 C31.D2
N$23  (via drill 0.61)
  Top 0.254: v32.38,77.47 33.66,77.47 36.2,80.01 36.2,81.92 C22.U2
  Bottom 0.254: v32.38,77.47 27.94,73.03 27.94,65.41 19.05,56.52 19.05,53.34 20.32,52.07 20.32,48.26 C21.F2
N$24  (via drill 0.61)
  Top 0.254: v33.66,163.19 34.92,164.47 34.92,170.81 38.1,173.99 38.1,191.13 40.01,193.04 42.55,193.04 C30.E1
  Bottom 0.254: v33.66,163.19 33.66,159.38 C30.T2
N$25
  Top 0.254: C30.F1 40.01,189.87 44.45,189.87 46.35,187.96 48.9,187.96 C31.H2
N$26
  Top 0.254: C31.N1 52.07,171.45 49.53,173.99 C31.M2 48.9,174.62 46.35,177.16 C31.L2
N$27  (via drill 0.61)
  Top 0.254: v11.43,59.69 17.14,53.98 17.14,51.44 C20.E1 | v15.24,66.67 47.62,66.67 v56.52,75.56 | v63.5,75.56 v73.03,85.09
  Bottom 0.254: v11.43,59.69 11.43,61.59 15.24,65.41 v15.24,66.67 | v56.52,75.56 v63.5,75.56 | v73.03,85.09 73.03,112.39 74.3,113.67 C3.H2
N$28
  Bottom 0.254: C31.N2 46.35,172.09 46.35,175.9 50.8,180.34 50.8,184.78 52.7,186.69 55.24,186.69 C31.H1
N$29
  Bottom 0.254: C31.K1 55.88,181.61 55.88,185.42 57.15,186.69 57.15,204.47 55.88,205.74 C31.A1
N$30
  Bottom 0.254: C31.K2 49.53,181.61 49.53,185.42 55.24,191.13 55.24,193.04 C31.E1
N$31
  Top 0.254: C3.T2 71.75,86.36 74.3,86.36 86.36,98.42 86.36,114.94 81.28,120.02 C3.E1
N$32  (via drill 0.61)
  Top 0.254: v43.18,153.67 26.04,153.67 1.91,129.54 1.91,73.03 7.62,67.31 7.62,64.77 14.61,57.78 17.14,57.78 C20.C1 | v47.62,181.61 48.26,182.25 65.41,182.25 71.12,187.96 71.12,189.87 C2.F2
  Bottom 0.254: v43.18,153.67 47.62,158.12 47.62,167.64 44.45,170.81 44.45,178.44 v47.62,181.61
N$33  (via drill 0.61)
  Top 0.254: v20.95,75.56 29.84,84.45 v38.1,84.45 | v53.98,114.94 57.78,118.75 67.31,118.75 v67.94,118.11 | v82.55,132.72 82.55,151.76 v78.74,155.57
  Bottom 0.254: v20.95,75.56 17.78,72.39 17.78,64.14 C20.A1 | v38.1,84.45 38.1,88.27 44.45,94.61 44.45,96.52 43.18,97.79 43.18,99.69 53.98,110.49 v53.98,114.94 | v82.55,132.72 v67.94,118.11 | v78.74,155.57 85.09,161.93 85.09,170.18 86.36,171.45 86.36,173.99 80.64,179.71 80.01,179.71 76.2,183.51 76.2,193.04 80.64,197.49 80.64,199.39 C2.C1
N$34  (via drill 0.61)
  Top 0.254: v10.16,130.18 15.24,135.25 15.24,136.53 29.84,151.13 48.9,151.13 v56.52,158.75 | v55.88,170.81 55.88,172.09 v59.69,175.9 | v66.67,175.9 73.66,182.88 78.74,182.88 79.38,183.51 79.38,188.59 78.11,189.87 C2.F1
  Bottom 0.254: v10.16,130.18 6.35,126.36 6.35,123.19 9.53,120.02 9.53,115.57 3.17,109.22 3.17,56.52 5.71,53.98 6.99,55.24 12.06,55.24 13.97,57.15 13.97,59.69 C20.B1 | v56.52,158.75 56.52,160.66 57.15,161.29 57.15,169.54 v55.88,170.81 | v66.67,175.9 v59.69,175.9
N$35
  Top 0.254: C1.E2 74.3,264.16 71.75,266.7 C1.D2
N$36  (via drill 0.61)
  Top 0.254: v83.82,231.14 74.93,240.03 74.93,243.84 C1.M2 | v81.28,184.15 76.2,179.07 v76.2,173.35 | v76.2,168.91 80.64,164.47 80.64,162.56 C2.S1
  Bottom 0.254: v83.82,231.14 83.82,191.77 82.55,190.5 82.55,185.42 v81.28,184.15 | v76.2,173.35 v76.2,168.91
N$37
  Bottom 0.254: C1.V2 71.12,222.88 71.12,226.69 69.85,227.97 69.85,233.04 71.12,234.31 C1.R2
N$38
  Top 0.254: C3.J2 71.75,111.76 76.2,111.76 78.11,113.67 80.64,113.67 C3.H1
N$39
  Top 0.254: C2.L1 78.11,178.44 80.64,180.97 C2.K1
N$40  (via drill 0.61)
  Top 0.254: 73.03,255.91 74.3,257.18 C1.H2 | 73.03,255.91 71.75,254.63 C1.J2 | 73.03,255.91 73.03,247.01 71.75,245.75 71.75,241.94 C1.N2 71.75,240.66 74.3,238.12 C1.P2 74.93,237.49 74.93,234.95 87,222.88 87,189.87 v86.36,189.23 | v86.36,186.69 85.09,185.42 85.09,175.26 85.72,174.62 v83.82,172.72
  Bottom 0.254: C32.J2 46.35,111.76 46.35,115.57 69.85,139.06 69.85,154.31 77.47,161.93 77.47,164.47 C2.R1 78.11,165.74 78.11,167.64 80.01,169.54 80.64,169.54 v83.82,172.72 | v86.36,186.69 v86.36,189.23
N$41
  Top 0.254: C2.M2 74.3,175.26 74.3,180.34 C2.K2
N$42
  Bottom 0.254: C31.U1 55.24,156.21 55.24,160.02 52.7,162.56 52.7,164.47 C31.R1
N$43  (via drill 0.61)
  Top 0.254: C2.E2 74.93,193.04 80.64,193.04 C2.E1 81.28,193.04 87.63,186.69 87.63,171.45 v86.36,170.18 | v12.7,57.15 13.97,55.88 13.97,54.61 C20.D1 | v20.95,83.82 v15.88,78.74
  Bottom 0.254: C2.B1 77.47,202.56 77.47,198.75 74.93,196.22 74.93,194.31 C2.E2 | v12.7,57.15 12.7,57.78 12.06,58.42 11.43,58.42 9.53,60.33 9.53,64.14 15.88,70.48 v15.88,78.74 | v20.95,83.82 53.98,116.84 53.98,121.92 75.56,143.51 75.56,152.4 77.47,154.31 80.01,154.31 80.64,154.94 C2.U1 81.28,156.21 86.36,161.29 v86.36,170.18
N$44
  Top 0.254: C2.J2 71.75,183.51 77.47,183.51 C2.J1
  Bottom 0.254: C2.V1 78.11,153.03 80.64,153.03 87.63,160.02 87.63,176.53 80.64,183.51 78.11,183.51 C2.J1
OPAUSEL  (via drill 0.61)
  Top 0.254: C21.J1 27.3,41.91 29.84,44.45 C21.H1 | v53.98,184.78 48.9,189.87 46.35,189.87 C31.F2 | v66.67,143.51 76.2,133.99 76.2,126.36 74.93,125.09 66.04,125.09 65.41,124.46 C27.D1 | v53.34,49.53 56.52,46.35 59.69,46.35 v60.96,47.62 | v82.55,112.39 79.38,109.22 79.38,104.14 78.11,102.87 70.48,102.87 v58.42,114.94
  Bottom 0.254: v53.98,184.78 53.98,173.99 59.69,168.28 59.69,166.37 66.67,159.38 v66.67,143.51 | v53.34,49.53 39.37,49.53 34.92,45.09 30.48,45.09 C21.H1 | v60.96,47.62 87,73.66 87,107.95 v82.55,112.39 | v58.42,114.94 64.77,121.28 64.77,123.19 C27.D1
PAUSE
  Bottom 0.254: C2.N1 77.47,172.09 77.47,173.99 74.3,177.16 71.75,177.16 C2.L2
PAUSEL  (via drill 0.61)
  Top 0.254: C31.P1 55.88,168.91 60.33,168.91 61.59,170.18 70.48,170.18 71.12,170.81 C2.N2 71.75,172.09 76.2,172.09 78.11,173.99 80.64,173.99 C2.M1 81.28,173.99 87.63,167.64 87.63,97.16 86.36,95.89 v86.36,71.75
  Bottom 0.254: v86.36,71.75 59.69,45.09 55.88,45.09 D31.H1
POWEROK  (via drill 0.61)
  Top 0.254: v57.15,123.19 v53.98,126.36
  Bottom 0.254: v57.15,123.19 57.15,112.39 49.53,104.78 49.53,102.23 C32.M2 | v53.98,126.36 53.98,147.32 58.42,151.76 B27.V2
SETPAUSE  (via drill 0.61)
  Top 0.254: v83.82,153.67 85.09,152.4 85.09,127.64 79.38,121.92 79.38,120.02 82.55,116.84 82.55,113.67 80.64,111.76 78.11,111.76 C3.J1 | v86.36,157.48 86.36,167.64 v81.92,172.09 | v84.45,174.62 84.45,184.78 81.28,187.96 C2.H1
  Bottom 0.254: v83.82,153.67 83.82,154.94 v86.36,157.48 | v81.92,172.09 v84.45,174.62
SKIPL  (via drill 0.61)
  Top 0.254: v59.05,100.33 52.07,107.31 49.53,107.31 C32.K2
  Bottom 0.254: C22.P2 36.83,95.89 36.83,97.79 46.35,107.31 48.9,107.31 C32.K2 | v59.05,100.33 67.94,91.44 67.94,89.53 C27.S1
STROBE  (via drill 0.61)
  Top 0.254: C31.M1 55.24,175.26 52.7,177.8 C31.L1 | C27.H2 62.23,114.94 66.67,114.94 67.31,115.57 76.2,115.57 77.47,116.84 C3.F1 | v69.85,163.19 76.83,163.19 v86.36,153.67
  Bottom 0.254: 86.36,111.12 80.64,116.84 78.11,116.84 C3.F1 | 86.36,111.12 87.63,109.86 87.63,67.94 55.88,36.2 55.88,32.38 D31.M1 | v69.85,163.19 59.05,173.99 55.88,173.99 C31.M1 | 86.36,111.12 v86.36,153.67
T2
  Bottom 0.254: A04.T2 8.26,86.36 12.7,86.36 13.34,87 19.68,87 20.32,86.36 D04.T2
TP3  (via drill 0.61)
  Top 0.254: v5.08,114.94 4.45,114.3 4.45,77.47 6.35,75.56 6.35,73.66 14.61,65.41 49.53,65.41 52.07,62.87 52.07,60.96 D31.B1 | v15.24,144.78 22.23,151.76 22.23,163.19 34.92,175.9 34.92,183.51 36.2,184.78 36.2,186.69 C30.H2 36.83,187.96 36.83,191.13 41.27,195.58 v41.27,196.85 | v50.8,224.16 57.15,230.5 57.15,243.84 71.12,257.81 71.12,259.71 C1.F2
  Bottom 0.254: v5.08,114.94 5.08,120.65 3.81,121.92 3.81,133.35 v15.24,144.78 | v50.8,224.16 49.53,222.88 49.53,220.34 50.16,219.71 50.16,209.55 41.27,200.66 v41.27,196.85
TP4  (via drill 0.61)
  Top 0.254: v69.85,80.01 v64.14,74.3 | v69.85,97.79 59.05,108.58 59.05,110.49 C27.J2 | v80.01,172.72 85.09,167.64 85.09,156.21 v85.72,155.57 | v83.82,152.4 83.82,127.64 72.39,116.2 v61.59,116.2
  Bottom 0.254: C1.T2 71.75,227.97 73.03,226.69 73.03,193.04 74.3,191.77 74.3,187.96 C2.H2 74.93,186.69 74.93,182.88 79.38,178.44 79.38,173.35 v80.01,172.72 | v64.14,74.3 64.14,63.5 55.88,55.24 55.88,51.44 D31.E1 | v69.85,97.79 v69.85,80.01 | v85.72,155.57 85.72,154.31 v83.82,152.4 | v61.59,116.2 59.05,113.67 59.05,111.76 C27.J2
V2
  Top 0.254: A04.V2 8.26,78.74 12.7,78.74 13.97,77.47 19.05,77.47 20.32,78.74 D04.V2
VCC  (via drill 0.61)
  Top 0.254: 48.26,277.5 41.91,277.5 41.27,276.86 36.83,276.86 D20.A2 | 48.26,277.5 48.9,276.86 D21.A2 | 48.26,277.5 69.22,277.5 69.85,276.86 74.3,276.86 C1.A2 | C30.A2 36.83,205.74 41.27,205.74 41.91,205.1 48.26,205.1 48.9,205.74 C31.A2 49.53,207.01 50.16,207.65 61.59,207.65 63.5,209.55 67.94,209.55 70.48,207.01 74.3,207.01 C2.A2 | 48.26,134.62 41.91,134.62 41.27,133.99 36.83,133.99 C22.A2 | 48.26,134.62 48.9,133.99 C32.A2 | 48.26,134.62 69.22,134.62 69.85,133.99 74.3,133.99 C3.A2 | D31.A2 48.9,62.87 48.26,62.23 41.91,62.23 41.27,62.87 36.83,62.87 D22.A2 36.2,64.14 31.75,64.14 31.11,64.77 24.77,64.77 24.13,64.14 C21.A2 | v17.78,59.69 14.61,62.87 11.43,62.87 C20.A2 | v60.33,104.14 v60.33,94.61 | v28.57,188.59 28.57,170.81 v26.04,168.28 | v32.38,163.19 v34.92,160.66
  Bottom 0.254: C1.A2 74.93,275.59 74.93,271.78 79.38,267.33 79.38,211.46 74.93,207.01 C2.A2 | v17.78,59.69 20.95,62.87 23.5,62.87 C21.A2 | v60.33,104.14 63.5,107.31 63.5,118.11 74.3,128.91 74.3,132.72 C3.A2 | v60.33,94.61 60.33,85.09 50.8,75.56 50.8,65.41 49.53,64.14 D31.A2 | v28.57,188.59 28.57,194.31 36.2,201.93 36.2,205.74 C30.A2 | v26.04,168.28 27.3,168.28 v32.38,163.19 | v34.92,160.66 34.92,135.25 36.2,133.99 C22.A2